# EAGLE design avr-isp-shield (EAGLE 6.3)
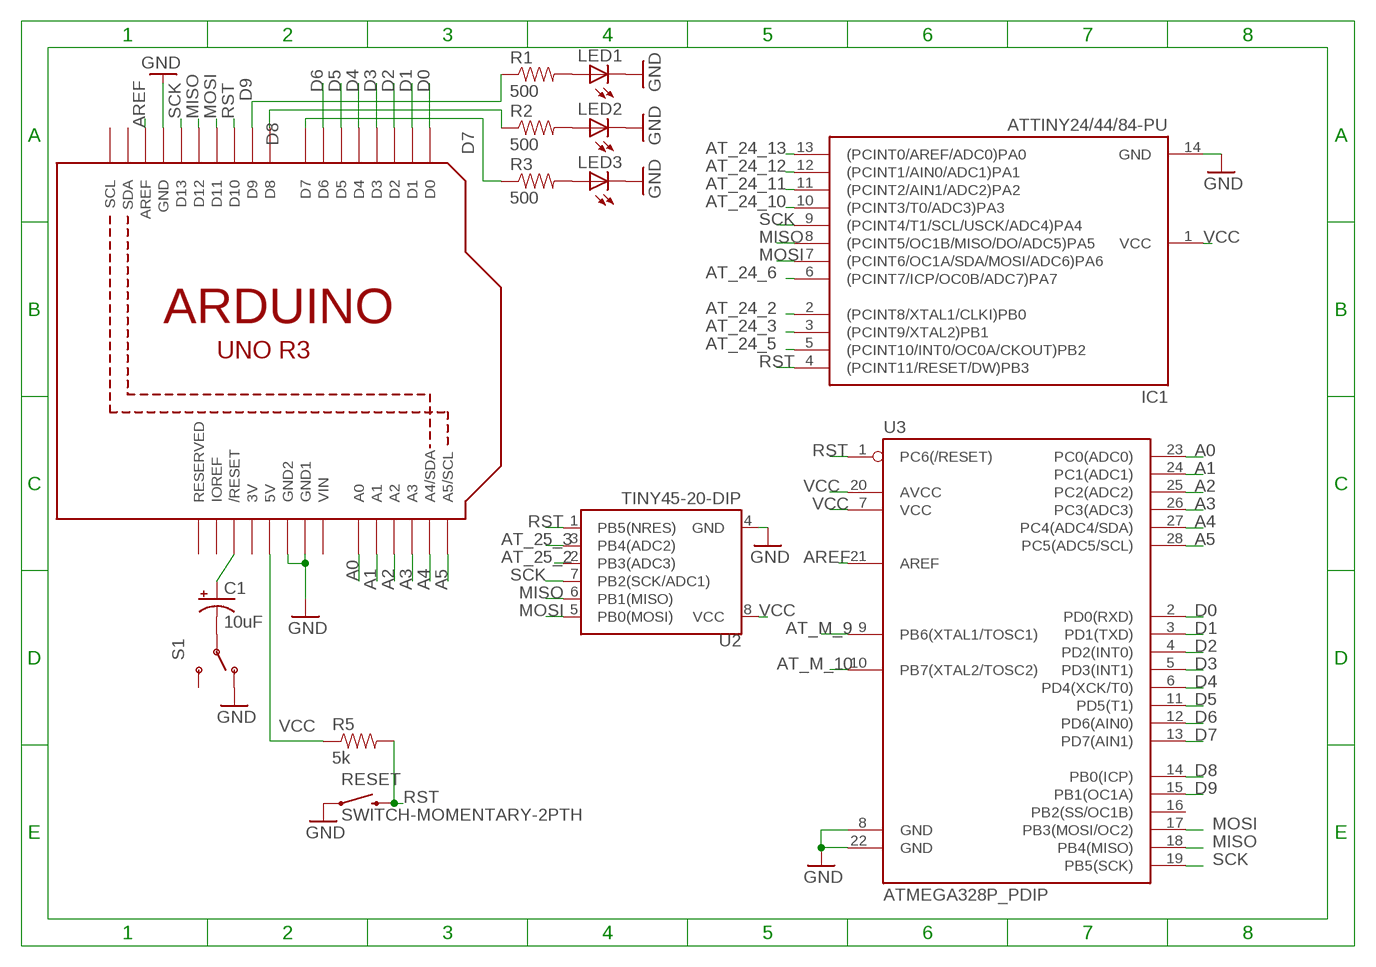
[diagram p0: schematic, sheet 1]

## Parts
C1  10uF  CAP_POLPTH2  [CPOL-RADIAL-10UF-25V]
IC1  ATTINY24/44/84-PU  [DIL14]
LED1  LED3MM  [LED3MM]
LED2  LED3MM  [LED3MM]
LED3  LED3MM  [LED3MM]
R1  500  RESISTORAXIAL-0.3  [AXIAL-0.3]
R2  500  RESISTORAXIAL-0.3  [AXIAL-0.3]
R3  500  RESISTORAXIAL-0.3  [AXIAL-0.3]
R5  5k  RESISTORAXIAL-0.3  [AXIAL-0.3]
RESET  SWITCH-MOMENTARY-2PTH  [TACTILE-PTH]
S1  SWITCH-SPDTPTH  [SWITCH-SPDT]
U2  TINY45-20-DIP  ATTINY45TINY45-20-DIP  [DIP08]
U3  ATMEGA328P_PDIP  [DIL28-3]
U4  ARDUINOR3-DIMENSION  [ARDUINOR3]

## Nets
A0: U3.23(PC0(ADC0)) U4.A0
A1: U3.24(PC1(ADC1)) U4.A1
A2: U3.25(PC2(ADC2)) U4.A2
A3: U3.26(PC3(ADC3)) U4.A3
A4: U3.27(PC4(ADC4/SDA)) U4.A4(A4/SDA)
A5: U3.28(PC5(ADC5/SCL)) U4.A5(A5/SCL)
AREF: U3.21(AREF) U4.AREF
AT_24_2: IC1.2((PCINT8/XTAL1/CLKI)PB0)
AT_24_3: IC1.3((PCINT9/XTAL2)PB1)
AT_24_5: IC1.5((PCINT10/INT0/OC0A/CKOUT)PB2)
AT_24_6: IC1.6((PCINT7/ICP/OC0B/ADC7)PA7)
AT_24_10: IC1.10((PCINT3/T0/ADC3)PA3)
AT_24_11: IC1.11((PCINT2/AIN1/ADC2)PA2)
AT_24_12: IC1.12((PCINT1/AIN0/ADC1)PA1)
AT_24_13: IC1.13((PCINT0/AREF/ADC0)PA0)
AT_25_2: U2.2(PB3(ADC3))
AT_25_3: U2.3(PB4(ADC2))
AT_M_9: U3.9(PB6(XTAL1/TOSC1))
AT_M_10: U3.10(PB7(XTAL2/TOSC2))
D0: U3.2(PD0(RXD)) U4.D0
D1: U3.3(PD1(TXD)) U4.D1
D2: U3.4(PD2(INT0)) U4.D2
D3: U3.5(PD3(INT1)) U4.D3
D4: U3.6(PD4(XCK/T0)) U4.D4
D5: U3.11(PD5(T1)) U4.D5
D6: U3.12(PD6(AIN0)) U4.D6
D7: R3.P$1 U3.13(PD7(AIN1)) U4.D7
D8: R2.P$1 U3.14(PB0(ICP)) U4.D8
D9: R1.P$1 U3.15(PB1(OC1A)) U4.D9
GND: IC1.14(GND) LED1.K(C) LED2.K(C) LED3.K(C) RESET.1 S1.1(O) U2.4(GND) U3.8(GND) U3.22(GND) U4.GND1 U4.GND2
MISO: IC1.8((PCINT5/OC1B/MISO/DO/ADC5)PA5) U2.6(PB1(MISO)) U3.18(PB4(MISO)) U4.D12
MOSI: IC1.7((PCINT6/OC1A/SDA/MOSI/ADC6)PA6) U2.5(PB0(MOSI)) U3.17(PB3(MOSI/OC2)) U4.D11
N$1: C1.1(+) U4.RESET(/RESET)
N$2: C1.2(-) S1.2(P)
N$5: LED1.A R1.P$2
N$6: LED2.A R2.P$2
N$7: LED3.A R3.P$2
N$10: U4.GND
RST: IC1.4((PCINT11/RESET/DW)PB3) R5.P$2 RESET.3 U2.1(PB5(NRES)) U3.1(PC6(/RESET)) U4.D10
SCK: IC1.9((PCINT4/T1/SCL/USCK/ADC4)PA4) U2.7(PB2(SCK/ADC1)) U3.19(PB5(SCK)) U4.D13
VCC: IC1.1(VCC) R5.P$1 U2.8(VCC) U3.7(VCC) U3.20(AVCC) U4.5V
Unconnected: S1.3(S) U3.16(PB2(SS/OC1B)) U4.IOREF U4.RESERVED U4.SCL U4.SDA

## Power pins joined to a net without a drawn wire
3V: U4.3V
VIN: U4.VIN

## Library data of the parts
C1 = SparkFun-Passives:CAP_POL: Capacitor Polarized These are standard SMD and PTH capacitors. Normally 10uF, 47uF, and 100uF in electrolytic and tantalum varieties. Always verify the external diameter of the through hole cap, it varies with capacity, voltage, and manufacturer. The EIA devices should be standard.
IC1 = attiny24_44_84:ATTINY24/44/84
LED1-LED3 = SparkFun-LED:LED: LEDs Standard schematic elements and footprints for 5mm, 3mm, 1206, and 0603 sized LEDs. 5mm - Spark Fun Electronics SKU : COM-00529 (and others)
R1-R3 R5 = SparkFun-Passives:RESISTOR: Resistor Basic schematic elements and footprints for 0603, 1206, and PTH resistors.
RESET = SparkFun-Electromechanical:SWITCH-MOMENTARY-2: Various NO switches- pushbuttons, reed, etc
S1 = SparkFun-Electromechanical:SWITCH-SPDT: SPDT Switch Simple slide switch, Spark Fun Electronics SKU : COM-00102 DPDT SMT slide switch, AYZ0202, SWCH-08179
U2 = SparkFun-DigitalIC:ATTINY45: Atmel 8-pin 2/4/8kB flash uC; PROD_ID: IC-09439
U3 = SparkFun-DigitalIC:ATMEGA328P_PDIP: uC used in the Arduino 32kb flash, 1k EEPROM, 2k SRAM This is the through-hole version of this chip.
U4 = adafruit:ARDUINOR3: This is a new object for the new Arduino R3 - with extra pins that you may want to use (such as IOref, and duplicated A4/A5

## Board
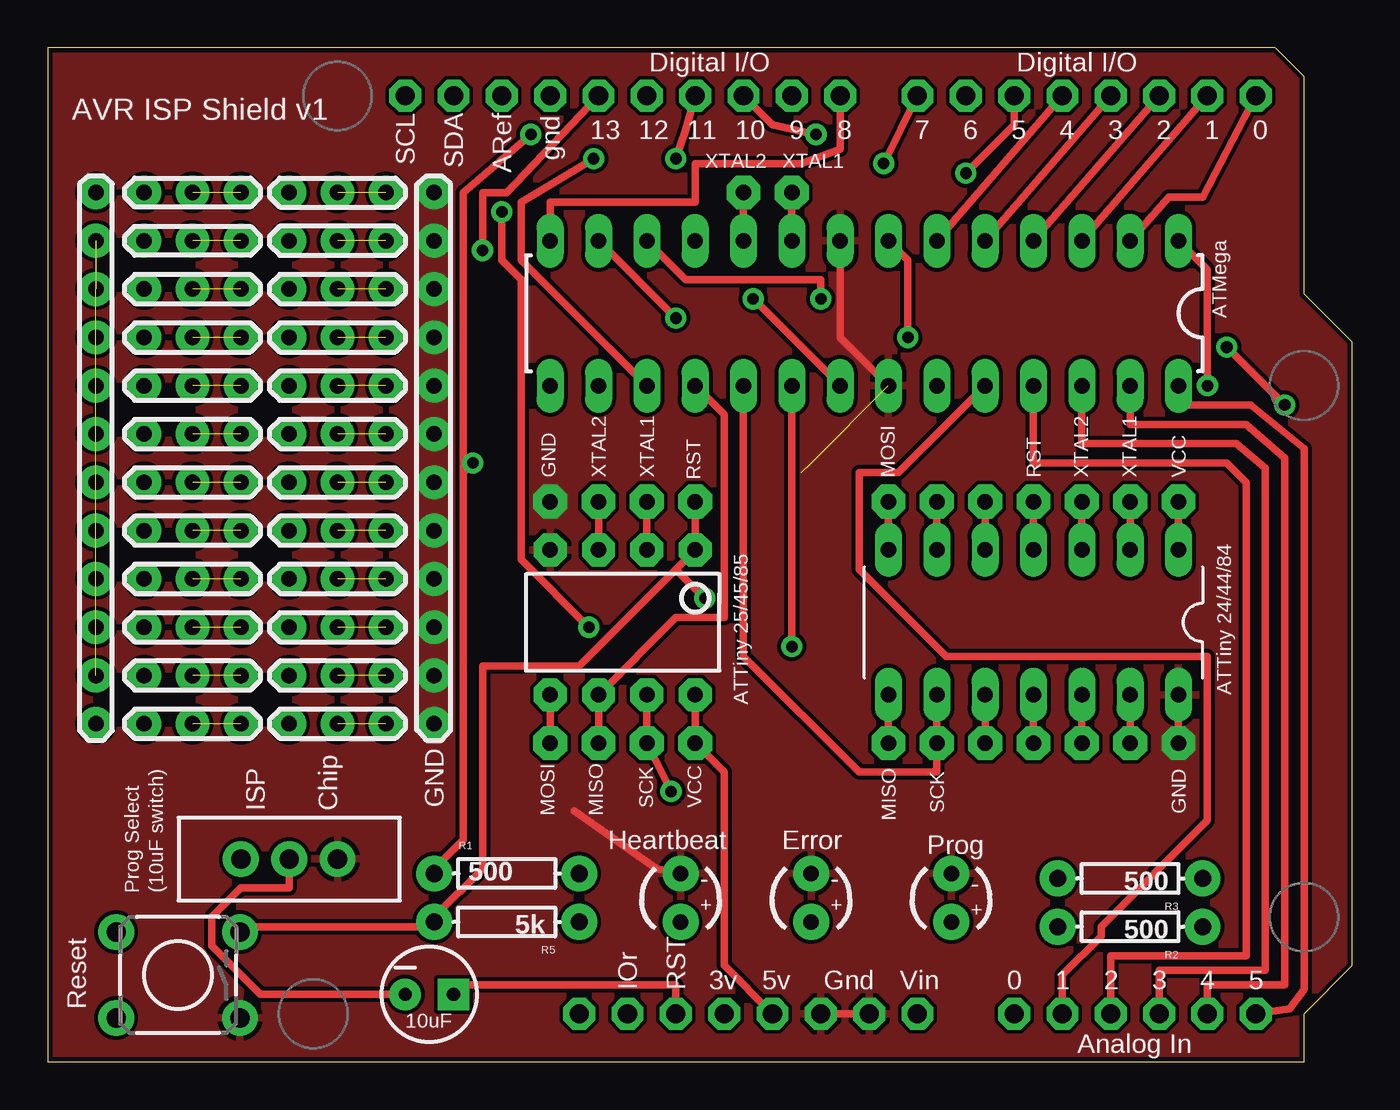
[diagram p1: board, top side]
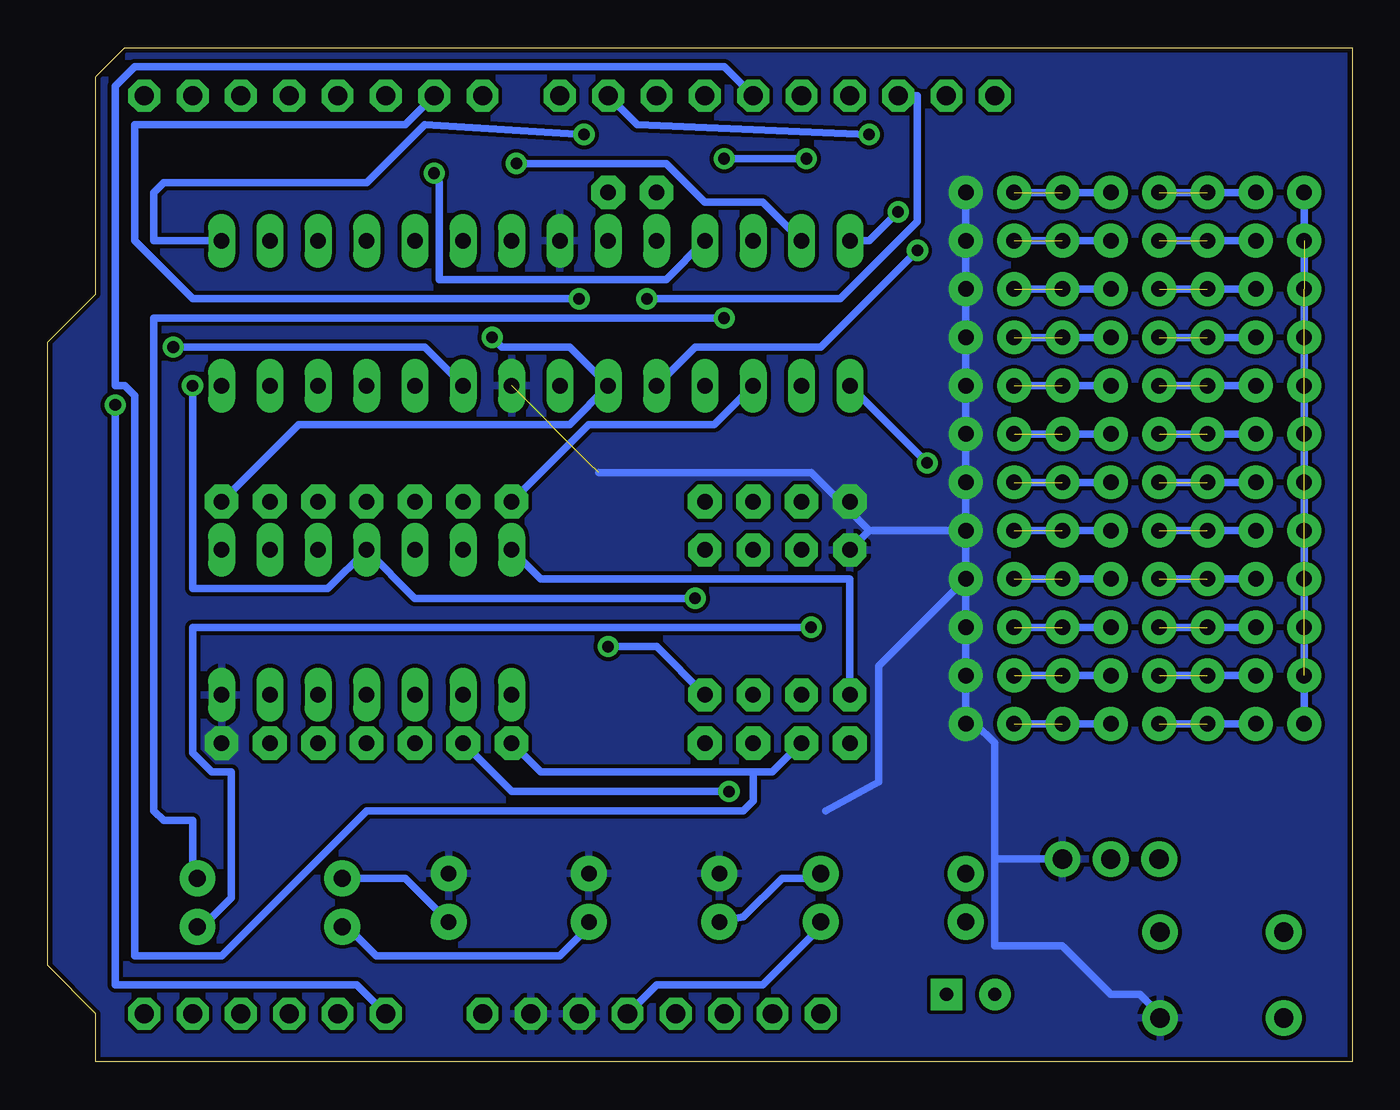
[diagram p2: board, bottom side, seen from below]

Size 68.58 x 53.34 mm. Coordinates in mm from the lower left corner, seen from the top.
Copper layers (1*16): Top 0.035mm / dielectric 1.5mm / Bottom 0.035mm
Design rules "SparkFun": minimum track width 8mil, minimum drill 20mil, track to track 8mil, track to pad 8mil, pad to pad 8mil, via to via 8mil, smd to smd 8mil, copper to edge 10mil, drill to drill 8mil, minimum pad ring 12mil, minimum via ring 10mil, stop-mask expansion 4mil, vias tented up to drill 25mil, thermal gap 10mil

### Footprints (pad centres in the part's own frame; a part is rotated, then mirrored left to right if it is on the bottom)
CPOL-RADIAL-10UF-25V = drill 0.7 pad 1.651 square: 1 1.27,0 | drill 0.7 pad 1.651: 2 -1.27,0
DIL14 = drill 0.813 long: 1 -7.62,-3.81; 2 -5.08,-3.81; 3 -2.54,-3.81; 4 0,-3.81; 5 2.54,-3.81; 6 5.08,-3.81; 7 7.62,-3.81; 8 7.62,3.81; 9 5.08,3.81; 10 2.54,3.81; 11 0,3.81; 12 -2.54,3.81; 13 -5.08,3.81; 14 -7.62,3.81
LED3MM = drill 0.813 pad 1.88: A -1.27,0; K 1.27,0
AXIAL-0.3 = drill 0.9 pad 1.88: P$1 -3.81,0; P$2 3.81,0
TACTILE-PTH = drill 1.016 pad 1.88: 1 -3.251,2.261; 2 3.251,2.261; 3 -3.251,-2.261; 4 3.251,-2.261
SWITCH-SPDT = drill 1.016 pad 1.88: 1 0,2.54; 2 0,0; 3 0,-2.54
DIP08 = drill 0.813 pad 1.727 octagon: 1 -3.81,-3.81; 2 -1.27,-3.81; 3 1.27,-3.81; 4 3.81,-3.81; 5 3.81,3.81; 6 1.27,3.81; 7 -1.27,3.81; 8 -3.81,3.81
DIL28-3 = drill 0.813 long: 1 -16.51,-3.81; 2 -13.97,-3.81; 3 -11.43,-3.81; 4 -8.89,-3.81; 5 -6.35,-3.81; 6 -3.81,-3.81; 7 -1.27,-3.81; 8 1.27,-3.81; 9 3.81,-3.81; 10 6.35,-3.81; 11 8.89,-3.81; 12 11.43,-3.81; 13 13.97,-3.81; 14 16.51,-3.81; 15 16.51,3.81; 16 13.97,3.81; 17 11.43,3.81; 18 8.89,3.81; 19 6.35,3.81; 20 3.81,3.81; 21 1.27,3.81; 22 -1.27,3.81; 23 -3.81,3.81; 24 -6.35,3.81; 25 -8.89,3.81; 26 -11.43,3.81; 27 -13.97,3.81; 28 -16.51,3.81
ARDUINOR3 = drill 1 pad 1.676 octagon: 3V 35.56,2.54; 5V 38.1,2.54; A0 50.8,2.54; A1 53.34,2.54; A2 55.88,2.54; A3 58.42,2.54; A4 60.96,2.54; A5 63.5,2.54; AREF 23.876,50.8; D0 63.5,50.8; D1 60.96,50.8; D2 58.42,50.8; D3 55.88,50.8; D4 53.34,50.8; D5 50.8,50.8; D6 48.26,50.8; D7 45.72,50.8; D8 41.656,50.8; D9 39.116,50.8; D10 36.576,50.8; D11 34.036,50.8; D12 31.496,50.8; D13 28.956,50.8; GND 26.416,50.8; GND1 43.18,2.54; GND2 40.64,2.54; IOREF 30.48,2.54; RESERVED 27.94,2.54; RESET 33.02,2.54; SCL 18.796,50.8; SDA 21.336,50.8; VIN 45.72,2.54

### Placement (x,y rotation side)
C1  20.07,3.56 0 top
IC1  51.82,23.11 180 top
LED1  33.27,8.64 90 top
LED2  40.13,8.64 90 top
LED3  47.5,8.64 90 top
R1  24.13,9.91 0 top
R2  56.9,7.11 180 top
R3  56.9,9.65 180 top
R5  24.13,7.37 180 top
RESET  6.86,4.57 180 top
S1  12.7,10.67 270 top
U2  30.23,23.11 180 top
U3  42.93,39.37 180 top
U4  0,0 0 top

### Tracks (layer width: path | path; a pad name or v marks a point on that pad's centre or on a via)
A0  (via drill 0.61)
  Top 0.406: v65.02,34.54 v61.98,37.59
  Bottom 0.406: U3.23 48.77,37.59 v61.98,37.59 | v65.02,34.54 65.02,4.06 52.32,4.06 U4.A0
A1
  Top 0.406: U3.24 44.7,30.99 42.67,30.99 42.67,25.91 47.24,21.34 60.96,21.34 60.96,12.7 55.37,7.11 55.37,6.6 53.34,4.57 U4.A1
A2
  Top 0.406: U4.A2 55.88,5.59 62.99,5.59 62.99,30.48 61.98,31.5 51.82,31.5 U3.25
A3
  Top 0.406: U4.A3 58.42,4.83 64.01,4.83 64.01,31.24 62.48,32.51 54.36,32.51 U3.26
A4
  Top 0.406: U4.A4 60.96,4.06 65.02,4.06 65.02,31.75 62.99,33.53 56.9,33.53 U3.27
A5
  Top 0.406: U3.28 59.44,34.54 63.25,34.54 66.04,32.26 66.04,3.81 65.28,2.79 U4.A5
AREF  (via drill 0.61)
  Top 0.406: v37.08,40.13 U3.21
  Bottom 0.406: U4.AREF 22.86,50.8 22.86,44.2 26.92,40.13 v37.08,40.13
AT_24_2  (via drill 0.81 pad 1.78)
  Top 0.406: IC1.2 v56.9,29.46
AT_24_3  (via drill 0.81 pad 1.78)
  Top 0.406: IC1.3 v54.36,29.46
AT_24_5  (via drill 0.81 pad 1.78)
  Top 0.406: v49.28,29.46 IC1.5
AT_24_6  (via drill 0.81 pad 1.78)
  Top 0.406: IC1.6 v46.74,29.46
AT_24_10  (via drill 0.81 pad 1.78)
  Top 0.406: v49.28,16.76 IC1.10
AT_24_11  (via drill 0.81 pad 1.78)
  Top 0.406: v51.82,16.76 IC1.11
AT_24_12  (via drill 0.81 pad 1.78)
  Top 0.406: v54.36,16.76 IC1.12
AT_24_13  (via drill 0.81 pad 1.78)
  Top 0.406: v56.9,16.76 IC1.13
AT_25_2  (via drill 0.81 pad 1.78)
  Top 0.406: U2.2 v31.5,29.46
AT_25_3  (via drill 0.81 pad 1.78)
  Top 0.406: v28.96,29.46 U2.3
AT_M_9  (via drill 0.81 pad 1.78)
  Top 0.406: v39.12,45.72 U3.9
AT_M_10  (via drill 0.81 pad 1.78)
  Top 0.406: v36.58,45.72 U3.10
D0
  Top 0.406: U3.2 58.93,45.47 60.71,45.47 U4.D0
D1
  Top 0.406: U3.3 U4.D1
D2
  Top 0.406: U4.D2 U3.4
D3
  Top 0.406: U4.D3 U3.5
D4
  Top 0.406: U4.D4 U3.6
D5  (via drill 0.61)
  Top 0.406: v48.26,46.74 50.8,49.28 U4.D5
  Bottom 0.406: U3.11 36.07,41.15 48.01,41.15 48.01,46.23 v48.26,46.74
D6  (via drill 0.61)
  Top 0.406: U3.12 33.53,41.15 40.64,41.15 v40.64,40.13
  Bottom 0.406: v40.64,40.13 60.96,40.13 64.01,43.18 64.01,49.28 49.78,49.28 U4.D6
D7  (via drill 0.61)
  Top 0.406: v33.02,39.12 U3.13 | v43.94,47.24 U4.D7
  Bottom 0.406: v33.02,39.12 62.99,39.12 62.99,13.21 62.48,12.7 60.96,12.7 60.96,9.65 R3.P$1 | v43.94,47.24 36.07,47.24 34.04,45.21 30.99,45.21 U3.13
D8  (via drill 0.61)
  Top 0.406: v28.45,22.86 24.89,26.42 24.89,41.15 23.88,42.16 v23.88,44.7 | U4.D8 41.66,48.01 39.62,47.24 34.04,47.24 34.04,45.21 26.42,45.21 U3.14
  Bottom 0.406: v28.45,22.86 60.96,22.86 60.96,16.26 59.94,15.24 58.93,15.24 58.93,8.64 60.45,7.11 R2.P$1 | v23.88,44.7 25.4,43.18 U3.14
D9  (via drill 0.61)
  Top 0.406: 21.84,30.99 v22.35,31.5 | 21.84,30.99 21.84,11.68 20.32,10.16 R1.P$1 | v25.4,48.77 21.84,45.72 21.84,30.99
  Bottom 0.406: v22.35,31.5 U3.15 | U4.D9 37.59,49.28 v25.4,48.77
GND  (via drill 0.81 pad 1.78)  (4 unrouted)
  Top 0.406: U4.GND1 U4.GND2 | 59.69,19.3 IC1.14 v59.44,16.76 | U3.22 41.66,38.1 U3.8 | 27.69,13.21 32,10.16 LED1.K
  Bottom 0.406: RESET.1 10.16,2.54 11.18,3.56 12.7,3.56 15.24,6.1 18.8,6.1 18.8,10.67 | 25.4,27.94 U2.4 | v20.32,27.94 25.4,27.94 | 39.62,30.99 28.45,30.99 26.92,29.46 | 25.4,27.94 26.92,29.46 | 18.8,10.67 18.8,16.76 19.81,17.78 | 19.81,17.78 20.32,18.29 v20.32,22.86 v20.32,25.4 | v20.32,25.4 v20.32,45.72 | 19.81,17.78 v20.32,17.78 | v26.42,29.46 26.92,29.46 | S1.1 18.8,10.67 | v20.32,25.4 24.89,20.83 24.89,14.73 27.69,13.21
  other vias: 20.32,43.18 20.32,40.64 20.32,38.1 20.32,35.56 20.32,33.02 20.32,30.48 20.32,20.32
  pour Top: -3.81,55.88 -3.81,-9.14 73.15,-7.37 75.18,60.45
  pour Bottom: -6.35,56.64 -7.37,-13.21 78.23,-9.91 81.03,68.58
MISO  (via drill 0.81 pad 1.78)
  Top 0.406: U3.18 35.56,34.04 35.56,23.37 33.02,23.37 U2.6 v28.96,16.76 | v44.2,16.76 IC1.8
  Bottom 0.406: v44.2,16.76 42.67,15.24 31.5,15.24 | 31.5,15.24 30.48,15.24 v28.96,16.76 | U4.D12 33.02,52.32 64.01,52.32 65.02,51.31 65.02,35.56 64.52,35.56 64.01,35.05 64.01,5.59 59.44,5.59 51.82,13.21 32,13.21 31.5,13.72 31.5,15.24
MOSI  (via drill 0.61, 0.81 pad 1.78)
  Top 0.406: v26.42,16.76 U2.5 | IC1.7 v44.2,29.46 | U4.D11 33.53,49.02 v33.02,47.5 | v28.7,47.5 24.89,45.21 24.89,42.16 U3.17
  Bottom 0.406: v44.2,29.46 40.13,33.53 33.53,33.53 U3.17 | U2.5 26.42,25.4 42.67,25.4 IC1.7 | v28.7,47.5 v33.02,47.5
N$1
  Top 0.406: U4.RESET 33.02,4.06 21.34,4.06 C1.1
N$2
  Top 0.406: C1.2 11.18,3.56 8.64,6.1 8.64,7.62 10.16,9.14 12.7,9.14 S1.2
N$4  (via drill 0.81 pad 1.78)  (1 unrouted)
  Bottom 0.406: v12.7,40.64 v17.78,40.64
  other vias: 15.24,40.64
N$5
  Bottom 0.406: LED1.A 32,7.62 29.97,9.65 27.94,9.65 R1.P$2
N$6
  Bottom 0.406: LED2.A 40.13,7.11 41.66,5.59 51.31,5.59 52.83,7.11 R2.P$2
N$7
  Bottom 0.406: LED3.A 49.78,9.65 R3.P$2
N$15  (via drill 0.81 pad 1.78)  (1 unrouted)
  Bottom 0.406: v12.7,43.18 v17.78,43.18
  other vias: 15.24,43.18
N$40  (via drill 0.81 pad 1.78)  (1 unrouted)
  Bottom 0.406: v12.7,45.72 v17.78,45.72
  other vias: 15.24,45.72
N$52  (via drill 0.81 pad 1.78)  (1 unrouted)
  Bottom 0.406: v12.7,38.1 v17.78,38.1
  other vias: 15.24,38.1
N$53  (via drill 0.81 pad 1.78)  (1 unrouted)
  Bottom 0.406: v12.7,35.56 v17.78,35.56
  other vias: 15.24,35.56
N$54  (via drill 0.81 pad 1.78)  (1 unrouted)
  Bottom 0.406: v12.7,33.02 v17.78,33.02
  other vias: 15.24,33.02
N$55  (via drill 0.81 pad 1.78)  (1 unrouted)
  Bottom 0.406: v12.7,30.48 v17.78,30.48
  other vias: 15.24,30.48
N$56  (via drill 0.81 pad 1.78)  (1 unrouted)
  Bottom 0.406: v12.7,27.94 v17.78,27.94
  other vias: 15.24,27.94
N$57  (via drill 0.81 pad 1.78)  (1 unrouted)
  Bottom 0.406: v12.7,25.4 v17.78,25.4
  other vias: 15.24,25.4
N$58  (via drill 0.81 pad 1.78)  (1 unrouted)
  Bottom 0.406: v12.7,22.86 v17.78,22.86
  other vias: 15.24,22.86
N$89  (via drill 0.81 pad 1.78)  (1 unrouted)
  Bottom 0.406: v12.7,17.78 v17.78,17.78
  other vias: 15.24,17.78
N$90  (via drill 0.81 pad 1.78)  (1 unrouted)
  Bottom 0.406: v12.7,20.32 v17.78,20.32
  other vias: 15.24,20.32
RST  (via drill 0.61, 0.81 pad 1.78)
  Top 0.406: v34.04,29.46 U2.1 33.02,25.91 | v51.82,29.46 IC1.4 | 33.02,25.91 27.94,20.83 22.86,20.83 22.86,10.16 20.32,7.62 R5.P$2 20.32,7.11 10.16,7.11 RESET.3 | U3.1 60.96,41.66 v60.96,35.56 | U4.D10 38.1,49.28 v40.39,48.77 | v34.54,24.38 33.02,25.91
  Bottom 0.406: v60.96,35.56 60.96,24.89 53.85,24.89 IC1.4 49.28,24.38 v34.54,24.38 | v40.39,48.77 48.77,49.28 51.82,46.23 62.48,46.23 62.99,45.72 62.99,43.18 U3.1
SCK  (via drill 0.61, 0.81 pad 1.78)
  Top 0.406: IC1.9 v46.74,16.76 46.74,15.24 42.67,15.24 36.58,21.34 U3.19 | v32.77,14.22 v31.5,16.76 U2.7 | U4.D13 24.13,45.72 22.86,45.72 v22.86,42.67
  Bottom 0.406: v32.77,14.22 44.2,14.22 v46.74,16.76 | v22.86,42.67 27.94,37.59 34.54,37.59 U3.19
UR_1_1  (via drill 0.81 pad 1.78)  (1 unrouted)
  Bottom 0.406: v5.08,45.72 v10.16,45.72
  other vias: 7.62,45.72
UR_2_1  (via drill 0.81 pad 1.78)  (1 unrouted)
  Bottom 0.406: v5.08,43.18 v10.16,43.18
  other vias: 7.62,43.18
UR_3_1  (via drill 0.81 pad 1.78)  (1 unrouted)
  Bottom 0.406: v10.16,40.64 v5.08,40.64
  other vias: 7.62,40.64
UR_4_1  (via drill 0.81 pad 1.78)  (1 unrouted)
  Bottom 0.406: v10.16,38.1 v5.08,38.1
  other vias: 7.62,38.1
UR_5_1  (via drill 0.81 pad 1.78)  (1 unrouted)
  Bottom 0.406: v10.16,35.56 v5.08,35.56
  other vias: 7.62,35.56
UR_6_1  (via drill 0.81 pad 1.78)  (1 unrouted)
  Bottom 0.406: v10.16,33.02 v5.08,33.02
  other vias: 7.62,33.02
UR_7_1  (via drill 0.81 pad 1.78)  (1 unrouted)
  Bottom 0.406: v10.16,30.48 v5.08,30.48
  other vias: 7.62,30.48
UR_8_1  (via drill 0.81 pad 1.78)  (1 unrouted)
  Bottom 0.406: v10.16,27.94 v5.08,27.94
  other vias: 7.62,27.94
UR_9_1  (via drill 0.81 pad 1.78)  (1 unrouted)
  Bottom 0.406: v10.16,25.4 v5.08,25.4
  other vias: 7.62,25.4
UR_10_1  (via drill 0.81 pad 1.78)  (1 unrouted)
  Bottom 0.406: v10.16,22.86 v5.08,22.86
  other vias: 7.62,22.86
UR_11_1  (via drill 0.81 pad 1.78)  (1 unrouted)
  Bottom 0.406: v5.08,20.32 v10.16,20.32
  other vias: 7.62,20.32
UR_12_1  (via drill 0.81 pad 1.78)  (1 unrouted)
  Bottom 0.406: v5.08,17.78 v10.16,17.78
  other vias: 7.62,17.78
UR_VCC  (via drill 0.81 pad 1.78)  (9 unrouted)
  Bottom 0.406: v2.54,17.78 v2.54,43.18 v2.54,45.72
  other vias: 2.54,40.64 2.54,38.1 2.54,35.56 2.54,33.02 2.54,30.48 2.54,27.94 2.54,25.4 2.54,22.86 2.54,20.32
VCC  (via drill 0.61, 0.81 pad 1.78)
  Top 0.406: U3.7 45.21,42.16 v45.21,38.1 | U2.8 v34.04,16.76 35.56,15.24 35.56,5.08 U4.5V | IC1.1 v59.44,29.46 | U3.20 v39.12,21.84
  Bottom 0.406: v45.21,38.1 44.7,37.59 41.15,37.59 U3.20 41.15,33.53 55.37,33.53 v59.44,29.46 | U4.5V 36.58,4.06 30.99,4.06 27.94,7.11 R5.P$1 | U2.8 36.58,21.84 v39.12,21.84

### Text on the board
tPlace: AVR ISP Shield v1 | XTAL2 | XTAL1 | ATMega | GND | XTAL2 | XTAL1 | RST | MOSI | RST | XTAL2 | XTAL1 | VCC | ATTiny 24/44/84 | ATTiny 25/45/85 | GND | ISP | Chip | MOSI | MISO | SCK | VCC | SCK | GND | MISO | Heartbeat | Error | Prog | Prog Select | (10uF switch) | - | - | - | + | + | + | Reset | 10uF